# Altium schematic sheet On_Off_Switches.SchDoc
size A4; SheetNumber: 4; SheetTotal: 10
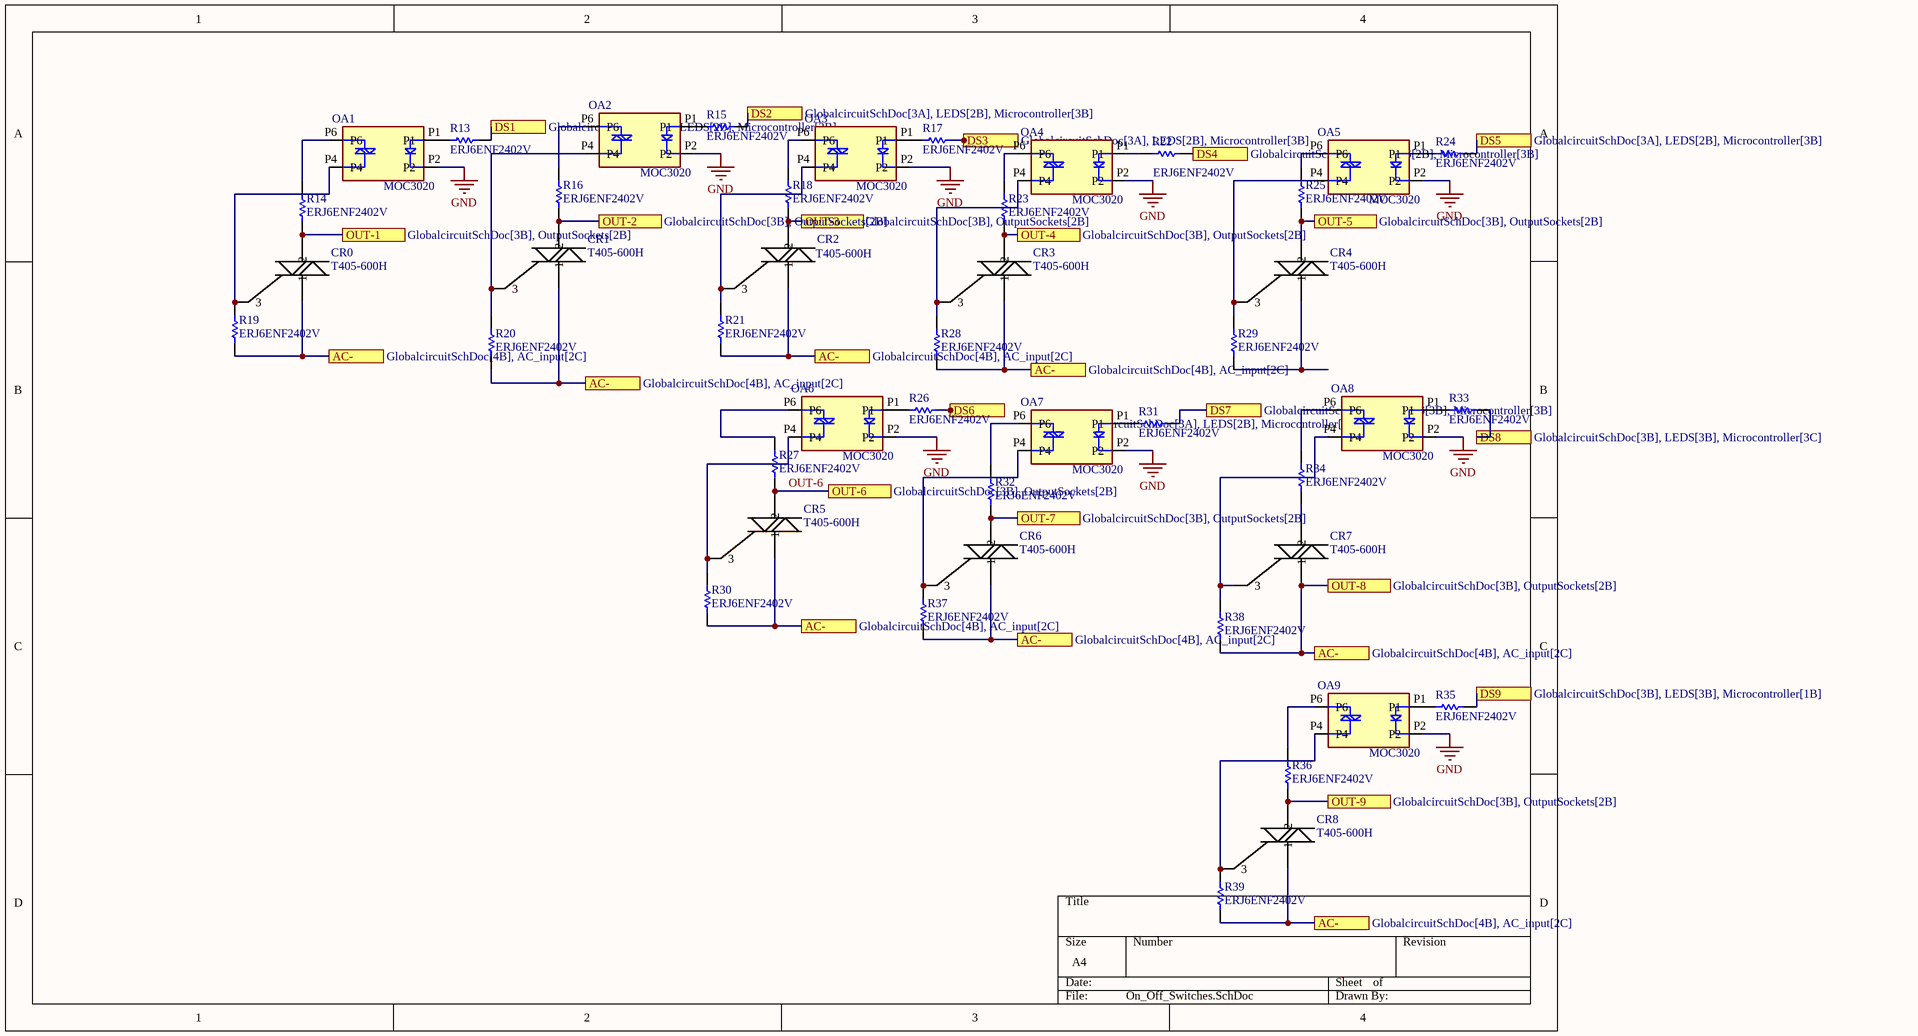
[diagram p0: On_Off_Switches.SchDoc]

## Parts
CR0  T405-600H  [IPAK_STM]
CR1  T405-600H  [IPAK_STM]
CR2  T405-600H  [IPAK_STM]
CR3  T405-600H  [IPAK_STM]
CR4  T405-600H  [IPAK_STM]
CR5  T405-600H  [IPAK_STM]
CR6  T405-600H  [IPAK_STM]
CR7  T405-600H  [IPAK_STM]
CR8  T405-600H  [IPAK_STM]
OA1  MOC3020S  [MOC3020S]  (value not drawn)
OA2  MOC3020S  [MOC3020S]  (value not drawn)
OA3  MOC3020S  [MOC3020S]  (value not drawn)
OA4  MOC3020S  [MOC3020S]  (value not drawn)
OA5  MOC3020S  [MOC3020S]  (value not drawn)
OA6  MOC3020S  [MOC3020S]  (value not drawn)
OA7  MOC3020S  [MOC3020S]  (value not drawn)
OA8  MOC3020S  [MOC3020S]  (value not drawn)
OA9  MOC3020S  [MOC3020S]  (value not drawn)
R13  ERJ6ENF2402V  [RESC2013X70X40ML20T20]
R14  ERJ6ENF2402V  [RESC2013X70X40ML20T20]
R15  ERJ6ENF2402V  [RESC2013X70X40ML20T20]
R16  ERJ6ENF2402V  [RESC2013X70X40ML20T20]
R17  ERJ6ENF2402V  [RESC2013X70X40ML20T20]
R18  ERJ6ENF2402V  [RESC2013X70X40ML20T20]
R19  ERJ6ENF2402V  [RESC2013X70X40ML20T20]
R20  ERJ6ENF2402V  [RESC2013X70X40ML20T20]
R21  ERJ6ENF2402V  [RESC2013X70X40ML20T20]
R22  ERJ6ENF2402V  [RESC2013X70X40ML20T20]
R23  ERJ6ENF2402V  [RESC2013X70X40ML20T20]
R24  ERJ6ENF2402V  [RESC2013X70X40ML20T20]
R25  ERJ6ENF2402V  [RESC2013X70X40ML20T20]
R26  ERJ6ENF2402V  [RESC2013X70X40ML20T20]
R27  ERJ6ENF2402V  [RESC2013X70X40ML20T20]
R28  ERJ6ENF2402V  [RESC2013X70X40ML20T20]
R29  ERJ6ENF2402V  [RESC2013X70X40ML20T20]
R30  ERJ6ENF2402V  [RESC2013X70X40ML20T20]
R31  ERJ6ENF2402V  [RESC2013X70X40ML20T20]
R32  ERJ6ENF2402V  [RESC2013X70X40ML20T20]
R33  ERJ6ENF2402V  [RESC2013X70X40ML20T20]
R34  ERJ6ENF2402V  [RESC2013X70X40ML20T20]
R35  ERJ6ENF2402V  [RESC2013X70X40ML20T20]
R36  ERJ6ENF2402V  [RESC2013X70X40ML20T20]
R37  ERJ6ENF2402V  [RESC2013X70X40ML20T20]
R38  ERJ6ENF2402V  [RESC2013X70X40ML20T20]
R39  ERJ6ENF2402V  [RESC2013X70X40ML20T20]

## Ports
AC- (see GlobalcircuitSchDoc[4B], AC_input[2C]), DS1 (see GlobalcircuitSchDoc[3A], LEDS[2B], Microcontroller[3B]), DS2 (see GlobalcircuitSchDoc[3A], LEDS[2B], Microcontroller[3B]), DS3 (see GlobalcircuitSchDoc[3A], LEDS[2B], Microcontroller[3B]), DS4 (see GlobalcircuitSchDoc[3A], LEDS[2B], Microcontroller[3B]), DS5 (see GlobalcircuitSchDoc[3A], LEDS[2B], Microcontroller[3B]), DS6 (see GlobalcircuitSchDoc[3A], LEDS[2B], Microcontroller[3B]), DS7 (see GlobalcircuitSchDoc[3A], LEDS[3B], Microcontroller[3B]), DS8 (see GlobalcircuitSchDoc[3B], LEDS[3B], Microcontroller[3C]), DS9 (see GlobalcircuitSchDoc[3B], LEDS[3B], Microcontroller[1B]), OUT-1 (see GlobalcircuitSchDoc[3B], OutputSockets[2B]), OUT-2 (see GlobalcircuitSchDoc[3B], OutputSockets[2B]), OUT-3 (see GlobalcircuitSchDoc[3B], OutputSockets[2B]), OUT-4 (see GlobalcircuitSchDoc[3B], OutputSockets[2B]), OUT-5 (see GlobalcircuitSchDoc[3B], OutputSockets[2B]), OUT-6 (see GlobalcircuitSchDoc[3B], OutputSockets[2B]), OUT-7 (see GlobalcircuitSchDoc[3B], OutputSockets[2B]), OUT-8 (see GlobalcircuitSchDoc[3B], OutputSockets[2B]), OUT-9 (see GlobalcircuitSchDoc[3B], OutputSockets[2B])

## Nets
GND: OA1.P2 OA2.P2 OA3.P2 OA4.P2 OA5.P2 OA6.P2 OA7.P2 OA8.P2 OA9.P2
AC-: CR0.1 CR1.1 CR2.1 CR3.1 CR5.1 CR6.1 CR7.1 CR8.1 R19.1 R20.1 R21.1 R28.1 R30.1 R37.1 R38.1 R39.1 ; port AC-, port OUT-8
DS1: R13.1 ; port DS1
DS2: R15.1 ; port DS2
DS3: R17.1 ; port DS3
DS4: R22.1 ; port DS4
DS5: R24.1 ; port DS5
DS6: R26.1 ; port DS6
DS7: R31.1 ; port DS7
DS8: R33.1 ; port DS8
DS9: R35.1 ; port DS9
OUT-1: CR0.2 R14.1 ; port OUT-1
OUT-2: CR1.2 R16.1 ; port OUT-2
OUT-3: CR2.2 R18.1 ; port OUT-3
OUT-4: CR3.2 R23.1 ; port OUT-4
OUT-5: CR4.2 R25.1 ; port OUT-5
OUT-6: CR5.2 R27.1 ; port OUT-6
OUT-7: CR6.2 R32.1 ; port OUT-7
OUT-9: CR8.2 R36.1 ; port OUT-9
NetCR0_3: CR0.3 OA1.P4 R19.2
NetCR1_3: CR1.3 OA2.P4 R20.2
NetCR2_3: CR2.3 OA3.P4 R21.2
NetCR3_3: CR3.3 OA4.P4 R28.2
NetCR4_1: CR4.1 R29.1
NetCR4_3: CR4.3 OA5.P4 R29.2
NetCR5_3: CR5.3 OA6.P4 R30.2
NetCR6_3: CR6.3 OA7.P4 R37.2
NetCR7_2: CR7.2 R34.1
NetCR7_3: CR7.3 OA8.P4 R38.2
NetCR8_3: CR8.3 OA9.P4 R39.2
NetOA1_P1: OA1.P1 R13.2
NetOA1_P6: OA1.P6 R14.2
NetOA2_P1: OA2.P1 R15.2
NetOA2_P6: OA2.P6 R16.2
NetOA3_P1: OA3.P1 R17.2
NetOA3_P6: OA3.P6 R18.2
NetOA4_P1: OA4.P1 R22.2
NetOA4_P6: OA4.P6 R23.2
NetOA5_P1: OA5.P1 R24.2
NetOA5_P6: OA5.P6 R25.2
NetOA6_P1: OA6.P1 R26.2
NetOA6_P6: OA6.P6 R27.2
NetOA7_P1: OA7.P1 R31.2
NetOA7_P6: OA7.P6 R32.2
NetOA8_P1: OA8.P1 R33.2
NetOA8_P6: OA8.P6 R34.2
NetOA9_P1: OA9.P1 R35.2
NetOA9_P6: OA9.P6 R36.2

## Notes on the sheet
- (in symbol MOC3020S) MOC3020

## Library data of the parts
CR0-CR8 = T405-600H: No Description Available; Mfr_Name: STMicroelectronics
OA1-OA9 = MOC3020S: Optoisolator Triac Output 5000Vrms 1 Channel 6-SMD; MF: Lite-On Inc.; SnapEDA_Link: https://www.snapeda.com/parts/MOC3020S/Lite-On+Inc./view-part/?ref=snap; Package: SMD-6 ON Semiconductor; Value: *; MP: MOC3020S; Check_prices: https://www.snapeda.com/parts/MOC3020S/Lite-On+Inc./view-part/?ref=eda
R13-R39 = CMP-2001-00525-1: Manufacturer: Panasonic; Part Number: ERJ6ENF2402V